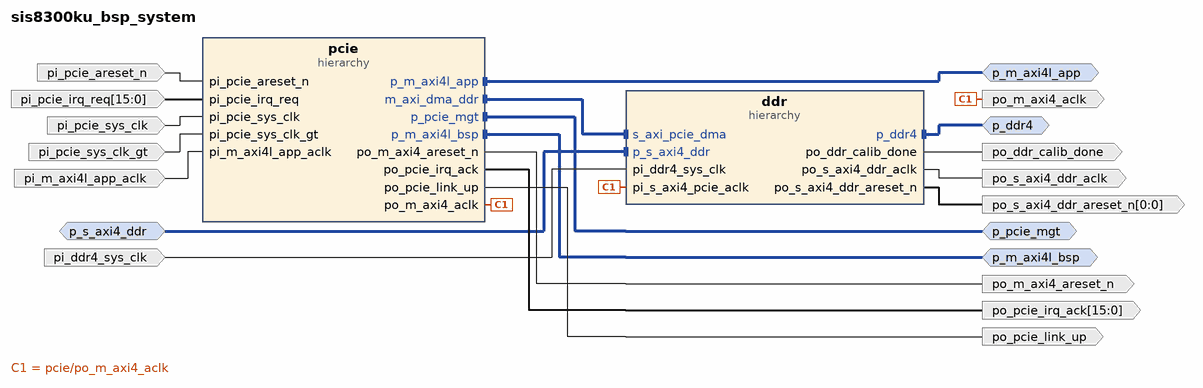
[diagram p0: block diagram of the top level]
# Vivado block design sis8300ku_bsp_system, xcku040-ffva1156-1-c, Vivado 2020.1
create_bd_design sis8300ku_bsp_system

create_bd_intf_port -mode Master -vlnv xilinx.com:interface:pcie_7x_mgt_rtl:1.0 p_pcie_mgt
create_bd_intf_port -mode Master -vlnv xilinx.com:interface:aximm_rtl:1.0 p_m_axi4l_bsp
set_property -dict {CONFIG.DATA_WIDTH 32 CONFIG.PROTOCOL AXI4LITE CONFIG.ADDR_WIDTH 23} [get_bd_intf_ports p_m_axi4l_bsp]
create_bd_intf_port -mode Master -vlnv xilinx.com:interface:aximm_rtl:1.0 p_m_axi4l_app
set_property -dict [list \
  CONFIG.DATA_WIDTH 32 \
  CONFIG.PROTOCOL AXI4LITE \
  CONFIG.FREQ_HZ 125000000 \
  CONFIG.ADDR_WIDTH 23 \
] [get_bd_intf_ports p_m_axi4l_app]
create_bd_intf_port -mode Master -vlnv xilinx.com:interface:ddr4_rtl:1.0 p_ddr4
create_bd_intf_port -mode Slave -vlnv xilinx.com:interface:aximm_rtl:1.0 p_s_axi4_ddr
set_property -dict [list \
  CONFIG.DATA_WIDTH 256 \
  CONFIG.PROTOCOL AXI4 \
  CONFIG.ID_WIDTH 4 \
  CONFIG.ADDR_WIDTH 32 \
  CONFIG.AWUSER_WIDTH 0 \
  CONFIG.ARUSER_WIDTH 0 \
  CONFIG.WUSER_WIDTH 0 \
  CONFIG.RUSER_WIDTH 0 \
  CONFIG.BUSER_WIDTH 0 \
  CONFIG.READ_WRITE_MODE READ_WRITE \
  CONFIG.HAS_BURST 1 \
  CONFIG.HAS_LOCK 1 \
  CONFIG.HAS_PROT 1 \
  CONFIG.HAS_CACHE 1 \
  CONFIG.HAS_QOS 1 \
  CONFIG.HAS_REGION 0 \
  CONFIG.HAS_WSTRB 1 \
  CONFIG.HAS_BRESP 1 \
  CONFIG.HAS_RRESP 1 \
  CONFIG.SUPPORTS_NARROW_BURST 1 \
  CONFIG.NUM_READ_OUTSTANDING 1 \
  CONFIG.NUM_WRITE_OUTSTANDING 1 \
  CONFIG.MAX_BURST_LENGTH 256 \
  CONFIG.NUM_READ_THREADS 1 \
  CONFIG.NUM_WRITE_THREADS 1 \
  CONFIG.RUSER_BITS_PER_BYTE 0 \
  CONFIG.WUSER_BITS_PER_BYTE 0 \
  CONFIG.master_id 0 \
] [get_bd_intf_ports p_s_axi4_ddr]
create_bd_port -dir I -type clk pi_m_axi4l_app_aclk
set_property -dict {CONFIG.ASSOCIATED_BUSIF p_m_axi4l_app CONFIG.FREQ_HZ 125000000} [get_bd_ports pi_m_axi4l_app_aclk]
create_bd_port -dir I -type clk pi_pcie_sys_clk
create_bd_port -dir I -type clk pi_pcie_sys_clk_gt
create_bd_port -dir I -type rst pi_pcie_areset_n
set_property -dict {CONFIG.POLARITY ACTIVE_LOW} [get_bd_ports pi_pcie_areset_n]
create_bd_port -dir O -type clk po_m_axi4_aclk
set_property -dict {CONFIG.ASSOCIATED_BUSIF p_m_axi4l_bsp} [get_bd_ports po_m_axi4_aclk]
create_bd_port -dir O -type rst po_m_axi4_areset_n
create_bd_port -dir O po_pcie_link_up
create_bd_port -dir O -from 15 -to 0 po_pcie_irq_ack
create_bd_port -dir I -from 15 -to 0 -type intr pi_pcie_irq_req
set_property -dict {CONFIG.PortWidth 16 CONFIG.SENSITIVITY EDGE_RISING} [get_bd_ports pi_pcie_irq_req]
create_bd_port -dir I -type clk pi_ddr4_sys_clk
set_property -dict {CONFIG.FREQ_HZ 125000000} [get_bd_ports pi_ddr4_sys_clk]
create_bd_port -dir O -type clk po_s_axi4_ddr_aclk
set_property -dict [list \
  CONFIG.ASSOCIATED_BUSIF p_s_axi4_ddr \
  CONFIG.ASSOCIATED_RESET po_s_axi4_ddr_areset_n \
] [get_bd_ports po_s_axi4_ddr_aclk]
create_bd_port -dir O -from 0 -to 0 -type rst po_s_axi4_ddr_areset_n
create_bd_port -dir O po_ddr_calib_done

create_bd_cell -type hier pcie
create_bd_cell -type hier ddr

# ---- hierarchy /pcie ----
current_bd_instance /pcie
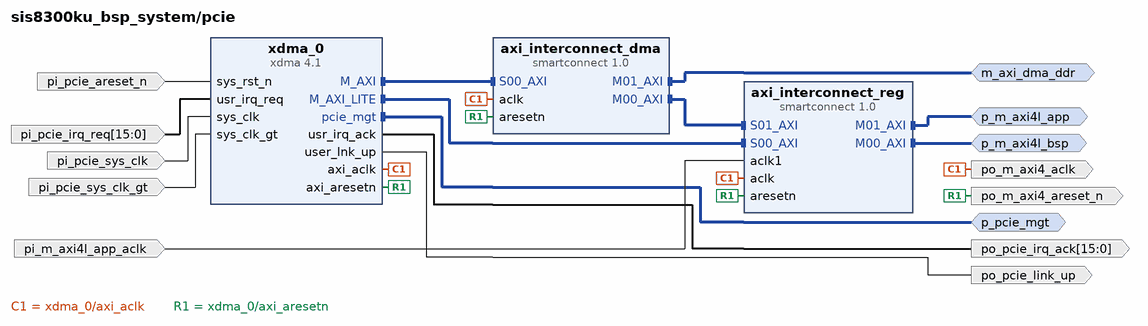
[diagram p1: block diagram inside /pcie]
create_bd_intf_pin -mode Master -vlnv xilinx.com:interface:aximm_rtl:1.0 m_axi_dma_ddr
create_bd_intf_pin -mode Master -vlnv xilinx.com:interface:pcie_7x_mgt_rtl:1.0 p_pcie_mgt
create_bd_intf_pin -mode Master -vlnv xilinx.com:interface:aximm_rtl:1.0 p_m_axi4l_bsp
create_bd_intf_pin -mode Master -vlnv xilinx.com:interface:aximm_rtl:1.0 p_m_axi4l_app
create_bd_pin -dir I -type rst pi_pcie_areset_n
create_bd_pin -dir O -type clk po_m_axi4_aclk
create_bd_pin -dir O -type rst po_m_axi4_areset_n
create_bd_pin -dir O -from 15 -to 0 po_pcie_irq_ack
create_bd_pin -dir O po_pcie_link_up
create_bd_pin -dir I -from 15 -to 0 pi_pcie_irq_req
create_bd_pin -dir I -type clk pi_pcie_sys_clk
create_bd_pin -dir I -type clk pi_pcie_sys_clk_gt
create_bd_pin -dir I -type clk pi_m_axi4l_app_aclk

create_bd_cell -type ip -vlnv xilinx.com:ip:xdma:4.1 xdma_0
set_property -dict [list \
  CONFIG.PF0_DEVICE_ID_mqdma 9024 \
  CONFIG.PF2_DEVICE_ID_mqdma 9024 \
  CONFIG.PF3_DEVICE_ID_mqdma 9024 \
  CONFIG.axi_data_width 128_bit \
  CONFIG.axilite_master_en true \
  CONFIG.axilite_master_size 16 \
  CONFIG.axisten_freq 125 \
  CONFIG.drp_clk_sel Internal \
  CONFIG.en_gt_selection true \
  CONFIG.enable_auto_rxeq False \
  CONFIG.enable_ibert false \
  CONFIG.enable_jtag_dbg false \
  CONFIG.mode_selection Advanced \
  CONFIG.pcie_blk_locn X0Y1 \
  CONFIG.pf0_device_id 8024 \
  CONFIG.pf0_link_status_slot_clock_config true \
  CONFIG.pl_link_cap_max_link_speed 5.0_GT/s \
  CONFIG.pl_link_cap_max_link_width X4 \
  CONFIG.plltype QPLL1 \
  CONFIG.ref_clk_freq 100_MHz \
  CONFIG.select_quad GTH_Quad_227 \
  CONFIG.xdma_axi_intf_mm AXI_Memory_Mapped \
  CONFIG.xdma_axilite_slave false \
  CONFIG.xdma_num_usr_irq 16 \
  CONFIG.xdma_sts_ports false \
] [get_bd_cells xdma_0]
create_bd_cell -type ip -vlnv xilinx.com:ip:smartconnect:1.0 axi_interconnect_reg
set_property -dict {CONFIG.NUM_CLKS 2 CONFIG.NUM_MI 2 CONFIG.NUM_SI 2} [get_bd_cells axi_interconnect_reg]
create_bd_cell -type ip -vlnv xilinx.com:ip:smartconnect:1.0 axi_interconnect_dma
set_property -dict {CONFIG.NUM_MI 2 CONFIG.NUM_SI 1} [get_bd_cells axi_interconnect_dma]

# ---- hierarchy /ddr ----
current_bd_instance /ddr
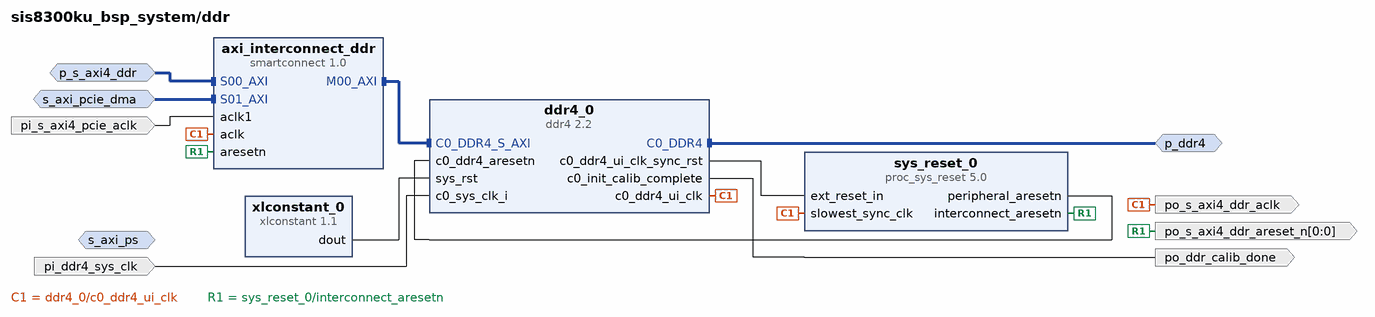
[diagram p2: block diagram inside /ddr]
create_bd_intf_pin -mode Slave -vlnv xilinx.com:interface:aximm_rtl:1.0 s_axi_pcie_dma
create_bd_intf_pin -mode Slave -vlnv xilinx.com:interface:aximm_rtl:1.0 s_axi_ps
create_bd_intf_pin -mode Master -vlnv xilinx.com:interface:ddr4_rtl:1.0 p_ddr4
create_bd_intf_pin -mode Slave -vlnv xilinx.com:interface:aximm_rtl:1.0 p_s_axi4_ddr
create_bd_pin -dir I -type clk pi_s_axi4_pcie_aclk
create_bd_pin -dir O -type clk po_s_axi4_ddr_aclk
create_bd_pin -dir I -type clk pi_ddr4_sys_clk
create_bd_pin -dir O po_ddr_calib_done
create_bd_pin -dir O -from 0 -to 0 -type rst po_s_axi4_ddr_areset_n

create_bd_cell -type ip -vlnv xilinx.com:ip:smartconnect:1.0 axi_interconnect_ddr
set_property -dict {CONFIG.NUM_CLKS 2 CONFIG.NUM_MI 1 CONFIG.NUM_SI 2} [get_bd_cells axi_interconnect_ddr]
create_bd_cell -type ip -vlnv xilinx.com:ip:proc_sys_reset:5.0 sys_reset_0
create_bd_cell -type ip -vlnv xilinx.com:ip:ddr4:2.2 ddr4_0
set_property -dict [list \
  CONFIG.C0.BANK_GROUP_WIDTH 1 \
  CONFIG.C0.DDR4_AxiAddressWidth 31 \
  CONFIG.C0.DDR4_AxiDataWidth 256 \
  CONFIG.C0.DDR4_CasLatency 11 \
  CONFIG.C0.DDR4_CasWriteLatency 11 \
  CONFIG.C0.DDR4_CustomParts custom_parts_ddr4.csv \
  CONFIG.C0.DDR4_DataWidth 64 \
  CONFIG.C0.DDR4_InputClockPeriod 8000 \
  CONFIG.C0.DDR4_MemoryPart H5AN4G6NAFR \
  CONFIG.C0.DDR4_Specify_MandD false \
  CONFIG.C0.DDR4_TimePeriod 1250 \
  CONFIG.C0.DDR4_isCustom true \
  CONFIG.System_Clock No_Buffer \
] [get_bd_cells ddr4_0]
create_bd_cell -type ip -vlnv xilinx.com:ip:xlconstant:1.1 xlconstant_0
set_property -dict {CONFIG.CONST_VAL 0} [get_bd_cells xlconstant_0]

# ---- connections ----

current_bd_instance /pcie
connect_bd_intf_net [get_bd_intf_pins p_pcie_mgt] [get_bd_intf_pins xdma_0/pcie_mgt]
connect_bd_intf_net [get_bd_intf_pins axi_interconnect_dma/S00_AXI] [get_bd_intf_pins xdma_0/M_AXI]
connect_bd_intf_net [get_bd_intf_pins m_axi_dma_ddr] [get_bd_intf_pins axi_interconnect_dma/M01_AXI]
connect_bd_intf_net [get_bd_intf_pins p_m_axi4l_app] [get_bd_intf_pins axi_interconnect_reg/M01_AXI]
connect_bd_intf_net [get_bd_intf_pins axi_interconnect_reg/S00_AXI] [get_bd_intf_pins xdma_0/M_AXI_LITE]
connect_bd_intf_net [get_bd_intf_pins axi_interconnect_reg/S01_AXI] [get_bd_intf_pins axi_interconnect_dma/M00_AXI]
connect_bd_intf_net [get_bd_intf_pins p_m_axi4l_bsp] [get_bd_intf_pins axi_interconnect_reg/M00_AXI]
connect_bd_net [get_bd_pins pi_pcie_areset_n] [get_bd_pins xdma_0/sys_rst_n]
connect_bd_net [get_bd_pins xdma_0/axi_aclk] \
  [get_bd_pins po_m_axi4_aclk] [get_bd_pins axi_interconnect_dma/aclk] [get_bd_pins axi_interconnect_reg/aclk]
connect_bd_net [get_bd_pins xdma_0/axi_aresetn] \
  [get_bd_pins po_m_axi4_areset_n] [get_bd_pins axi_interconnect_dma/aresetn] [get_bd_pins axi_interconnect_reg/aresetn]
connect_bd_net [get_bd_pins xdma_0/usr_irq_ack] [get_bd_pins po_pcie_irq_ack]
connect_bd_net [get_bd_pins xdma_0/user_lnk_up] [get_bd_pins po_pcie_link_up]
connect_bd_net [get_bd_pins pi_pcie_irq_req] [get_bd_pins xdma_0/usr_irq_req]
connect_bd_net [get_bd_pins pi_pcie_sys_clk] [get_bd_pins xdma_0/sys_clk]
connect_bd_net [get_bd_pins pi_pcie_sys_clk_gt] [get_bd_pins xdma_0/sys_clk_gt]
connect_bd_net [get_bd_pins pi_m_axi4l_app_aclk] [get_bd_pins axi_interconnect_reg/aclk1]

current_bd_instance /ddr
connect_bd_intf_net [get_bd_intf_pins axi_interconnect_ddr/M00_AXI] [get_bd_intf_pins ddr4_0/C0_DDR4_S_AXI]
connect_bd_intf_net [get_bd_intf_pins p_s_axi4_ddr] [get_bd_intf_pins axi_interconnect_ddr/S00_AXI]
connect_bd_intf_net [get_bd_intf_pins p_ddr4] [get_bd_intf_pins ddr4_0/C0_DDR4]
connect_bd_intf_net [get_bd_intf_pins s_axi_pcie_dma] [get_bd_intf_pins axi_interconnect_ddr/S01_AXI]
connect_bd_net [get_bd_pins pi_ddr4_sys_clk] [get_bd_pins ddr4_0/c0_sys_clk_i]
connect_bd_net [get_bd_pins ddr4_0/c0_ddr4_ui_clk] \
  [get_bd_pins po_s_axi4_ddr_aclk] [get_bd_pins axi_interconnect_ddr/aclk] [get_bd_pins sys_reset_0/slowest_sync_clk]
connect_bd_net [get_bd_pins ddr4_0/c0_init_calib_complete] [get_bd_pins po_ddr_calib_done]
connect_bd_net [get_bd_pins sys_reset_0/interconnect_aresetn] [get_bd_pins axi_interconnect_ddr/aresetn] [get_bd_pins po_s_axi4_ddr_areset_n]
connect_bd_net [get_bd_pins pi_s_axi4_pcie_aclk] [get_bd_pins axi_interconnect_ddr/aclk1]
connect_bd_net [get_bd_pins ddr4_0/c0_ddr4_ui_clk_sync_rst] [get_bd_pins sys_reset_0/ext_reset_in]
connect_bd_net [get_bd_pins sys_reset_0/peripheral_aresetn] [get_bd_pins ddr4_0/c0_ddr4_aresetn]
connect_bd_net [get_bd_pins xlconstant_0/dout] [get_bd_pins ddr4_0/sys_rst]

current_bd_instance /
connect_bd_intf_net [get_bd_intf_ports p_pcie_mgt] [get_bd_intf_pins pcie/p_pcie_mgt]
connect_bd_intf_net [get_bd_intf_ports p_m_axi4l_app] [get_bd_intf_pins pcie/p_m_axi4l_app]
connect_bd_intf_net [get_bd_intf_ports p_ddr4] [get_bd_intf_pins ddr/p_ddr4]
connect_bd_intf_net [get_bd_intf_ports p_s_axi4_ddr] [get_bd_intf_pins ddr/p_s_axi4_ddr]
connect_bd_intf_net [get_bd_intf_ports p_m_axi4l_bsp] [get_bd_intf_pins pcie/p_m_axi4l_bsp]
connect_bd_intf_net [get_bd_intf_pins pcie/m_axi_dma_ddr] [get_bd_intf_pins ddr/s_axi_pcie_dma]
connect_bd_net [get_bd_ports pi_pcie_areset_n] [get_bd_pins pcie/pi_pcie_areset_n]
connect_bd_net [get_bd_pins pcie/po_m_axi4_aclk] [get_bd_ports po_m_axi4_aclk] [get_bd_pins ddr/pi_s_axi4_pcie_aclk]
connect_bd_net [get_bd_pins pcie/po_m_axi4_areset_n] [get_bd_ports po_m_axi4_areset_n]
connect_bd_net [get_bd_pins pcie/po_pcie_irq_ack] [get_bd_ports po_pcie_irq_ack]
connect_bd_net [get_bd_pins pcie/po_pcie_link_up] [get_bd_ports po_pcie_link_up]
connect_bd_net [get_bd_ports pi_pcie_irq_req] [get_bd_pins pcie/pi_pcie_irq_req]
connect_bd_net [get_bd_ports pi_pcie_sys_clk] [get_bd_pins pcie/pi_pcie_sys_clk]
connect_bd_net [get_bd_ports pi_pcie_sys_clk_gt] [get_bd_pins pcie/pi_pcie_sys_clk_gt]
connect_bd_net [get_bd_ports pi_m_axi4l_app_aclk] [get_bd_pins pcie/pi_m_axi4l_app_aclk]
connect_bd_net [get_bd_ports pi_ddr4_sys_clk] [get_bd_pins ddr/pi_ddr4_sys_clk]
connect_bd_net [get_bd_pins ddr/po_ddr_calib_done] [get_bd_ports po_ddr_calib_done]
connect_bd_net [get_bd_pins ddr/po_s_axi4_ddr_areset_n] [get_bd_ports po_s_axi4_ddr_areset_n]
connect_bd_net [get_bd_pins ddr/po_s_axi4_ddr_aclk] [get_bd_ports po_s_axi4_ddr_aclk]

# ---- address map ----
assign_bd_address -offset 0x80000000 -range 2G -target_address_space [get_bd_addr_spaces p_s_axi4_ddr] [get_bd_addr_segs ddr/ddr4_0/C0_DDR4_MEMORY_MAP/C0_DDR4_ADDRESS_BLOCK]
assign_bd_address -offset 0x0000000000000000 -range 4M -target_address_space [get_bd_addr_spaces pcie/xdma_0/M_AXI] [get_bd_addr_segs p_m_axi4l_bsp/Reg]
assign_bd_address -offset 0x0000000000800000 -range 8M -target_address_space [get_bd_addr_spaces pcie/xdma_0/M_AXI] [get_bd_addr_segs p_m_axi4l_app/Reg]
assign_bd_address -offset 0x0000000080000000 -range 2G -target_address_space [get_bd_addr_spaces pcie/xdma_0/M_AXI] [get_bd_addr_segs ddr/ddr4_0/C0_DDR4_MEMORY_MAP/C0_DDR4_ADDRESS_BLOCK]
assign_bd_address -offset 0x00000000 -range 4M -target_address_space [get_bd_addr_spaces pcie/xdma_0/M_AXI_LITE] [get_bd_addr_segs p_m_axi4l_bsp/Reg]
assign_bd_address -offset 0x00800000 -range 8M -target_address_space [get_bd_addr_spaces pcie/xdma_0/M_AXI_LITE] [get_bd_addr_segs p_m_axi4l_app/Reg]

validate_bd_design
save_bd_design
